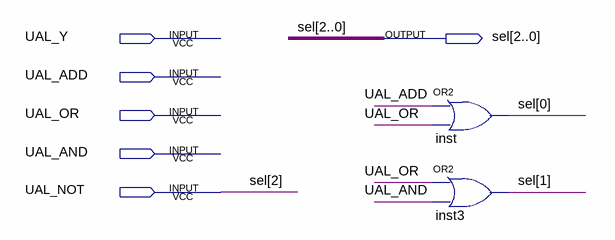
[diagram p0: schematic sheet]
// Quartus schematic codific_ula.bdf as structural Verilog: 2 symbols, 6 pins
module codific_ula (
  input  UAL_Y,
  input  UAL_ADD,
  input  UAL_OR,
  input  UAL_AND,
  input  UAL_NOT,
  output [2:0] sel
);

  or inst (sel[0], UAL_ADD, UAL_OR);
  or inst3 (sel[1], UAL_OR, UAL_AND);

  assign sel[2] = UAL_NOT;
endmodule
